# Altium schematic sheet ESC_Main.SchDoc
size A4; SheetNumber: 1; SheetTotal: 1
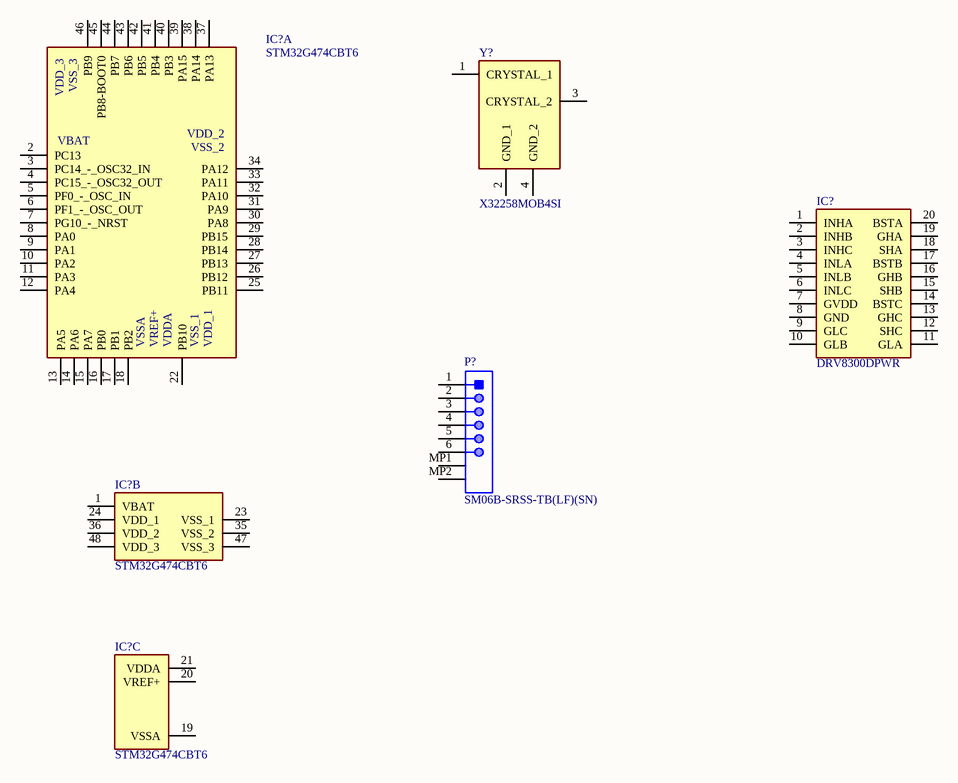
[diagram p0: ESC_Main.SchDoc]

## Parts
(Parts that share a designator on the sheet are numbered #1, #2 ... from top to bottom, then left to right.)
IC?#1  STM32G474CBT6  [QFP50P900X900X160-48N]  (part A of 3)
IC?#2  DRV8300DPWR  [SOP65P640X120-20N]
IC?#3  STM32G474CBT6  [QFP50P900X900X160-48N]  (part B of 3)
IC?#4  STM32G474CBT6  [QFP50P900X900X160-48N]  (part C of 3)
P?  SM06B-SRSS-TB(LF)(SN)  [JST-SM06B-SRSS-TB_V]
Y?  X32258MOB4SI  [X32258MOB4SI]

## Nets

Not connected (* = marked no-connect by the designer): IC?#1 2(PC13) 3(PC14_-_OSC32_IN) 4(PC15_-_OSC32_OUT) 5(PF0_-_OSC_IN) 6(PF1_-_OSC_OUT) 7(PG10_-_NRST) 8(PA0) 9(PA1) 10(PA2) 11(PA3) 12(PA4) 13(PA5) 14(PA6) 15(PA7) 16(PB0) 17(PB1) 18(PB2) 22(PB10) 25(PB11) 26(PB12) 27(PB13) 28(PB14) 29(PB15) 30(PA8) 31(PA9) 32(PA10) 33(PA11) 34(PA12) 37(PA13) 38(PA14) 39(PA15) 40(PB3) 41(PB4) 42(PB5) 43(PB6) 44(PB7) 45(PB8-BOOT0) 46(PB9); IC?#2 1(INHA) 2(INHB) 3(INHC) 4(INLA) 5(INLB) 6(INLC) 7(GVDD) 8(GND) 9(GLC) 10(GLB) 11(GLA) 12(SHC) 13(GHC) 14(BSTC) 15(SHB) 16(GHB) 17(BSTB) 18(SHA) 19(GHA) 20(BSTA); IC?#3 1(VBAT) 23(VSS_1) 24(VDD_1) 35(VSS_2) 36(VDD_2) 47(VSS_3) 48(VDD_3); IC?#4 19(VSSA) 20(VREF+) 21(VDDA); P? 1 2 3 4 5 6 MP1 MP2; Y? 1(CRYSTAL_1) 2(GND_1) 3(CRYSTAL_2) 4(GND_2)

## Library data of the parts
IC?#1 IC?#3 IC?#4 = STM32G474CBT6: Integrated Circuit; Manufacturer Name: STMicroelectronics; Manufacturer Part Number: STM32G474CBT6TR; Datasheet Link: https://www.st.com/resource/en/datasheet/stm32g474cb.pdf; Height: 1.6mm; Mouser Part Number: 511-STM32G474CBT6TR; Mouser Price/Stock: https://www.mouser.co.uk/ProductDetail/STMicroelectronics/STM32G474CBT6TR?qs=sPbYRqrBIVmx65Oml6enIQ%3D%3D; Arrow Part Number: STM32G474CBT6TR; Arrow Price/Stock: https://www.arrow.com/en/products/stm32g474cbt6tr/stmicroelectronics.html?utm_currency=USD&region=nac; LCSC: C730123
IC?#2 = DRV8300DPWR: Integrated Circuit; Manufacturer_Name: Texas Instruments; Height: 1.2mm; Manufacturer_Part_Number: DRV8300DPWR; Mouser Part Number: 595-DRV8300DPWR; Mouser Price/Stock: https://www.mouser.co.uk/ProductDetail/Texas-Instruments/DRV8300DPWR?qs=eP2BKZSCXI6qJbKdYnGwBg%3D%3D; Arrow Part Number: DRV8300DPWR; Arrow Price/Stock: https://www.arrow.com/en/products/drv8300dpwr/texas-instruments?utm_currency=USD&region=nac
P? = CMP-2000-07080-1: Male Header, Pitch 1 mm, 1 x 6 Position, Height 2.95 mm, -25 to 85 degC, RoHS, Tape and Reel; Manufacturer: JST; No of Positions: 6; Pitch: 1mm; Style/Orientation: RightAngleHeader/Plug; Datasheet URL: https://datasheet.ciiva.com/26894/getdatasheetpartid-708885-26894671.pdf; Package Description: Male Header, Pitch 1 mm, 1 X 6 Position, Height 2.9 mm; Termination: Solder; Manufacturer URL: http://www.jst.com/home2.html; Type: ShroudedHeader; Package Reference: SM06B-SRSS-TB; Datasheet Version: 11/2010; Mounting Technology: SurfaceMount
Y? = X32258MOB4SI: Crystal or Oscillator; Manufacturer_Name: YXC; Datasheet Link: https://item.szlcsc.com/datasheet/X32258MOB4SI/2777872.html; Height: 0.8mm; Manufacturer_Part_Number: X32258MOB4SI